# Altium schematic sheet Audio.SchDoc: AUDIO
size A4; DrawnBy: D KLEISS; Revision: 1; SheetNumber: 3; SheetTotal: 15
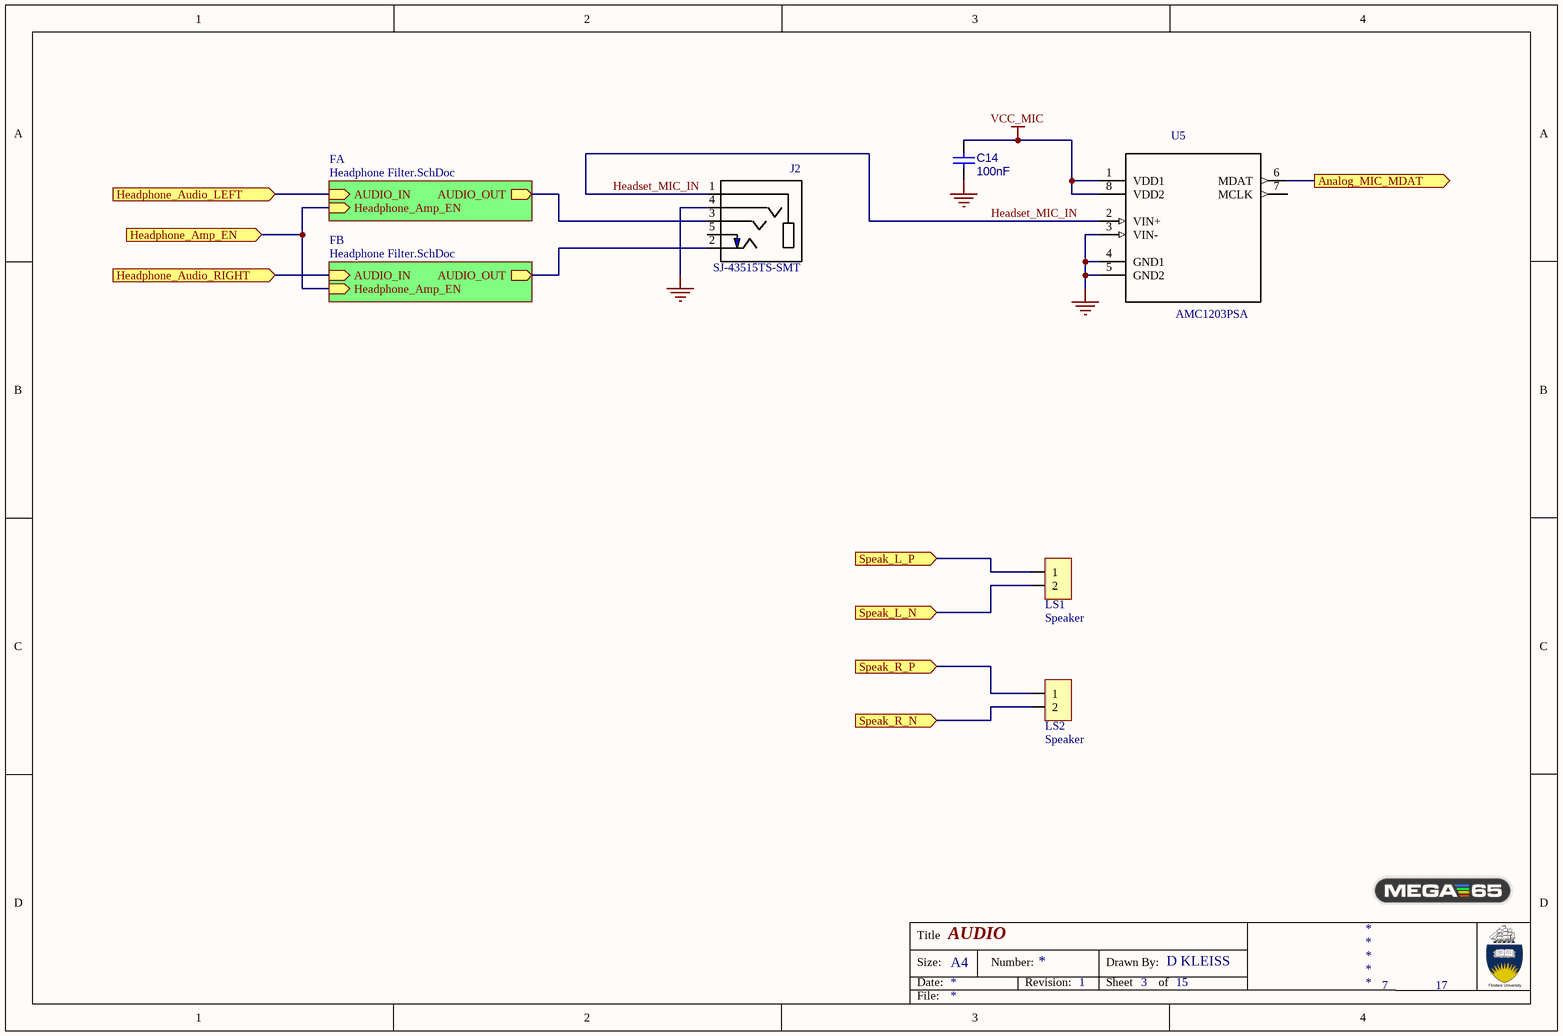
[diagram p0: Audio.SchDoc]

## Parts
C14  100nF  [0603_CAP UF HD]
J2  SJ-43515TS-SMT  [SOCKET 3.5 TRRS CUI_SJ-43515TS-SMT]
LS1  Speaker  [HDR1X2]
LS2  Speaker  [HDR1X2]
U5  AMC1203PSA  [AMC1203]

## Sub-sheets
FA = Headphone Filter.SchDoc: AUDIO_IN (in), AUDIO_OUT (out), Headphone_Amp_EN (in)
FB = Headphone Filter.SchDoc: AUDIO_IN (in), AUDIO_OUT (out), Headphone_Amp_EN (in)

## Ports
Analog_MIC_MDAT (out), Headphone_Amp_EN (in), Headphone_Audio_LEFT (in), Headphone_Audio_RIGHT (in), Speak_L_N (in), Speak_L_P (in), Speak_R_N (in), Speak_R_P (in)

## Nets
GND: C14.2 J2.4(RING2) U5.3(VIN-) U5.4(GND1) U5.5(GND2)
VCC_MIC: C14.1 U5.1(VDD1) U5.8(VDD2)
Analog_MIC_MDAT: U5.6(MDAT) ; port Analog_MIC_MDAT
Headphone_Amp_EN: port Headphone_Amp_EN, sheet FA/Headphone_Amp_EN, sheet FB/Headphone_Amp_EN
Headphone_Audio_LEFT: port Headphone_Audio_LEFT, sheet FA/AUDIO_IN
Headphone_Audio_RIGHT: port Headphone_Audio_RIGHT, sheet FB/AUDIO_IN
Headset_MIC_IN: J2.1(SLEEVE) U5.2(VIN+)
Speak_L_N: LS1.2 ; port Speak_L_N
Speak_L_P: LS1.1 ; port Speak_L_P
Speak_R_N: LS2.2 ; port Speak_R_N
Speak_R_P: LS2.1 ; port Speak_R_P
NetJ2_2: J2.2(TIP) ; sheet FB/AUDIO_OUT
NetJ2_3: J2.3(RING1) ; sheet FA/AUDIO_OUT

Not connected (* = marked no-connect by the designer): J2 5(TIP_SWITCH); U5 7(MCLK)

## Notes on the sheet
- 7
- 17
- Title
- Size:
- Date:
- A4
- Number:
- Revision:
- Sheet
- Drawn By:
- of
- File:

## Library data of the parts
C14 = Cap: Capacitor; Value: 100nF
J2 = SJ-43515TS-SMT: SJ Series 3.5 mm 16 V 4 Conductor SMT Mid Mount Stereo Audio Jack; Manufacturer: CUI; Manufacturer Number: SJ-43515TS-SMT-TR; Digikey Number: CP-43515TSSJCT-ND
LS1 LS2 = CON2
U5 = AMC1203PSA: Single Channel Single ADC Delta-Sigma 40ksps 16-bit Serial 8-Pin SOP Tube; Manufacturer: Texas Instruments; Digikey Number: 296-27654-5-ND; Manufacturer Number: AMC1203PSA